# EasyEDA schematic Zabezpieczenie_samochodowe_2021-03-07.json
TITLE: Zabezpieczenie samochodu przed kradzieżą; REV: 1.0; Date: 2021-02-28; Sheet: 1/1; Drawn By: Maciej_Trawka
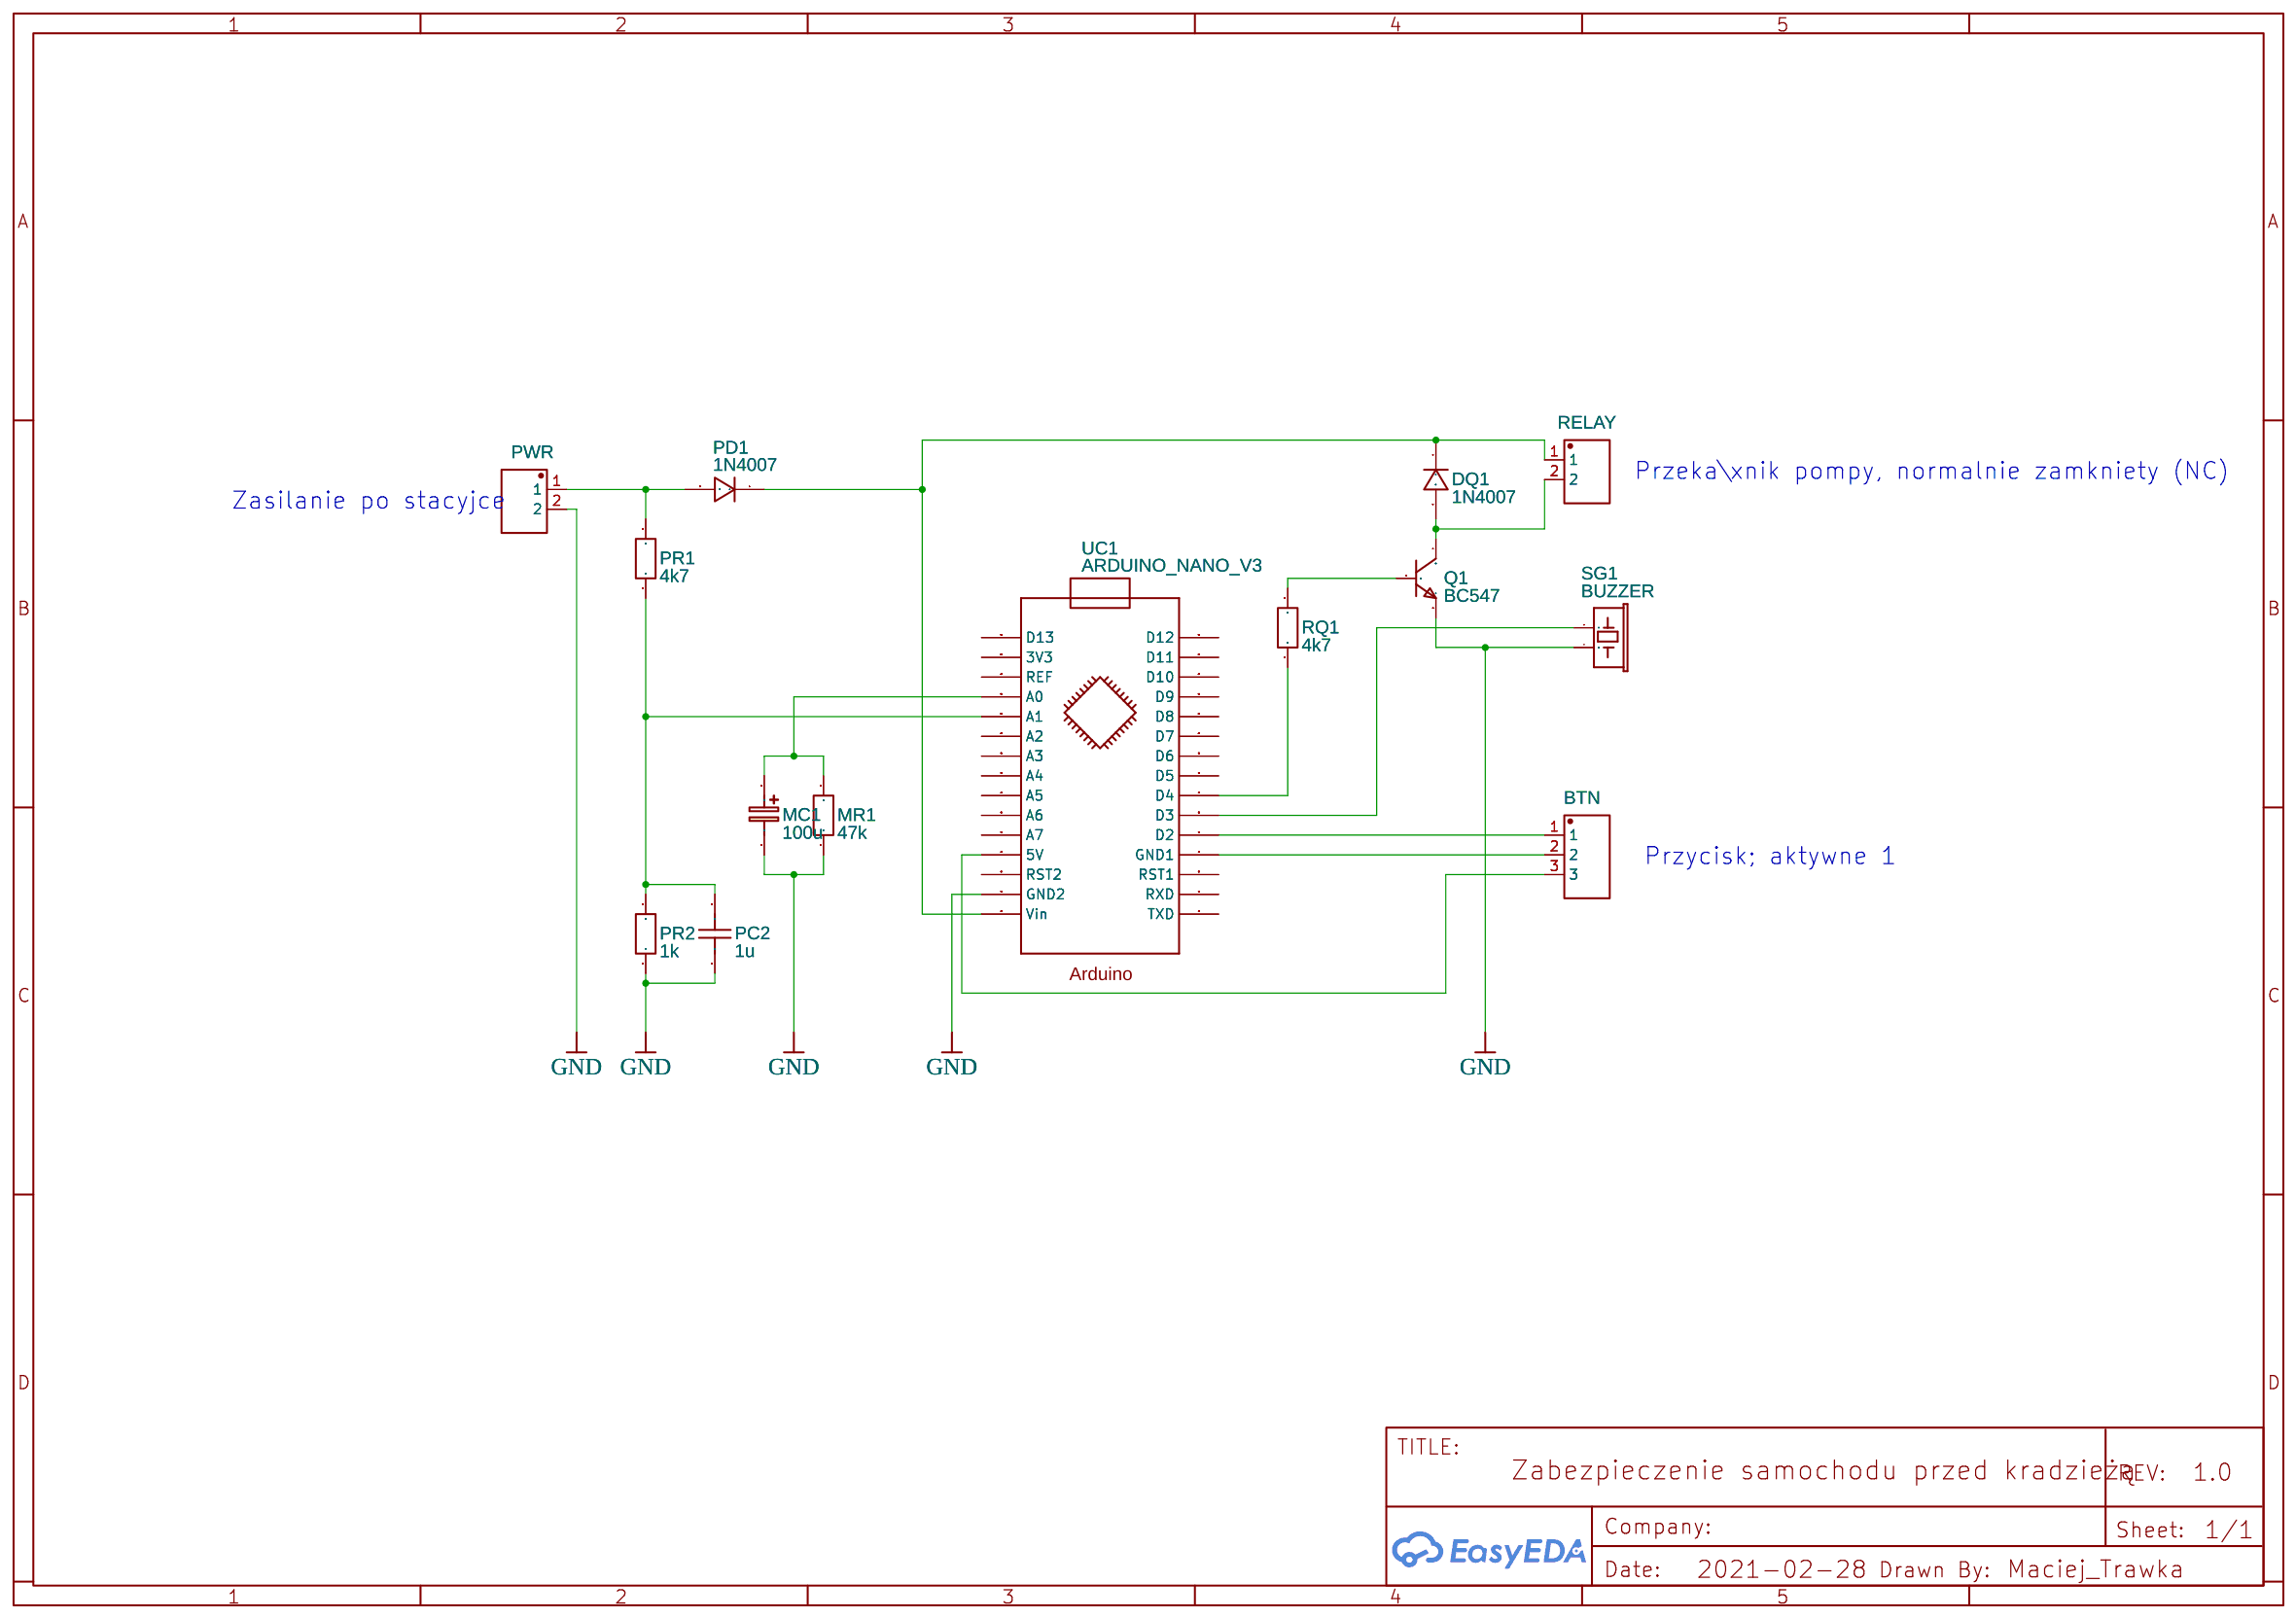
[diagram p0: schematic sheet]

## Parts
BTN  WJ15EDGVC-3P  [WJ15EDGVC-3.81-3P]
DQ1  1N4007  [DO-41_BD2.4-L4.7-P8.70-D0.9-RD]
MC1  100u  [CAP-D5.0×F2.0]
MR1  47k  [R_AXIAL-0.3]
PC2  1u  [RAD-0.2]
PD1  1N4007  [DO-41_BD2.4-L4.7-P8.70-D0.9-RD]
PR1  4k7  [R_AXIAL-0.3]
PR2  1k  [R_AXIAL-0.3]
PWR  WJ15EDGVC-3.81-2P  [WJ15EDGVC-3.81-2P]
Q1  BC547  [BC547]
RELAY  WJ15EDGVC-3.81-2P  [WJ15EDGVC-3.81-2P]
RQ1  4k7  [R_AXIAL-0.3]
SG1  BUZZER  [BUZZER-12MM-NS]
UC1  ARDUINO_NANO_V3  [ARDUINO NANO V3]

## Library data of the parts
BTN = -: Supplier: LCSC; Manufacturer: ReliaPro; image: //image.lceda.cn/szlcsc/C8389.jpg; Supplier Part: C8389
DQ1 PD1 = 1N4007: Supplier: LCSC; Manufacturer: SEMTECH; Supplier Part: C106903; Contributor: LCEDA_Lib
MC1 = CE_TH_D5.0×F2.0_EU: Contributor: LCEDA_Lib
MR1 PR1 PR2 RQ1 = R_AXIAL-0.3_EU: Contributor: LCEDA_Lib
PC2 = C_RAD-0.2_US: Contributor: LCEDA_Lib
PWR RELAY = -: Supplier: LCSC; Manufacturer: ReliaPro; image: //image.lceda.cn/szlcsc/C8396.jpg; Supplier Part: C8396
Q1 = BC547: Supplier Part: C258144; Manufacturer: ON Semicon; Manufacturer Part: BC547BTA; Contributor: HTDvN
SG1 = BUZZER: Contributor: SparkFun
UC1 = ARDUINO_NANO_V3: Manufacturer Part: arduino_nano1; Contributor: mali oglasi

## Nets
GND: MC1.2 MR1.1 PC2.1 PR2.1 PWR.2 Q1.3(E) SG1.-(2) UC1.J2.2(GND2)
Net-(BTN-1): BTN.1 UC1.J1.5(D2)
Net-(BTN-2): BTN.2 UC1.J1.4(GND1)
Net-(BTN-3): BTN.3 UC1.J2.4(5V)
Net-(DQ1-1): DQ1.1 PD1.1 RELAY.1 UC1.J2.1(Vin)
Net-(DQ1-2): DQ1.2 Q1.1(C) RELAY.2
Net-(MC1-1): MC1.1 MR1.2 UC1.J2.12(A0)
Net-(PC2-2): PC2.2 PR1.1 PR2.2 UC1.J2.11(A1)
Net-(PD1-2): PD1.2 PR1.2 PWR.1
Net-(Q1-2): Q1.2(B) RQ1.2
Net-(RQ1-1): RQ1.1 UC1.J1.7(D4)
Net-(SG1-+): SG1.+(1) UC1.J1.6(D3)

Not connected (* = marked no-connect by the designer): UC1 J1.1(TXD) J1.2(RXD) J1.3(RST1) J1.8(D5) J1.9(D6) J1.10(D7) J1.11(D8) J1.12(D9) J1.13(D10) J1.14(D11) J1.15(D12) J2.3(RST2) J2.5(A7) J2.6(A6) J2.7(A5) J2.8(A4) J2.9(A3) J2.10(A2) J2.13(REF) J2.14(3V3) J2.15(D13)

## Notes on the sheet
- Przeka\xnik pompy, normalnie zamkniety (NC)
- Zasilanie po stacyjce
- Przycisk; aktywne 1
